# Altium project Hospital_Ward_Management_System_Project_V1I1.PrjPcb (part 3 of 3)
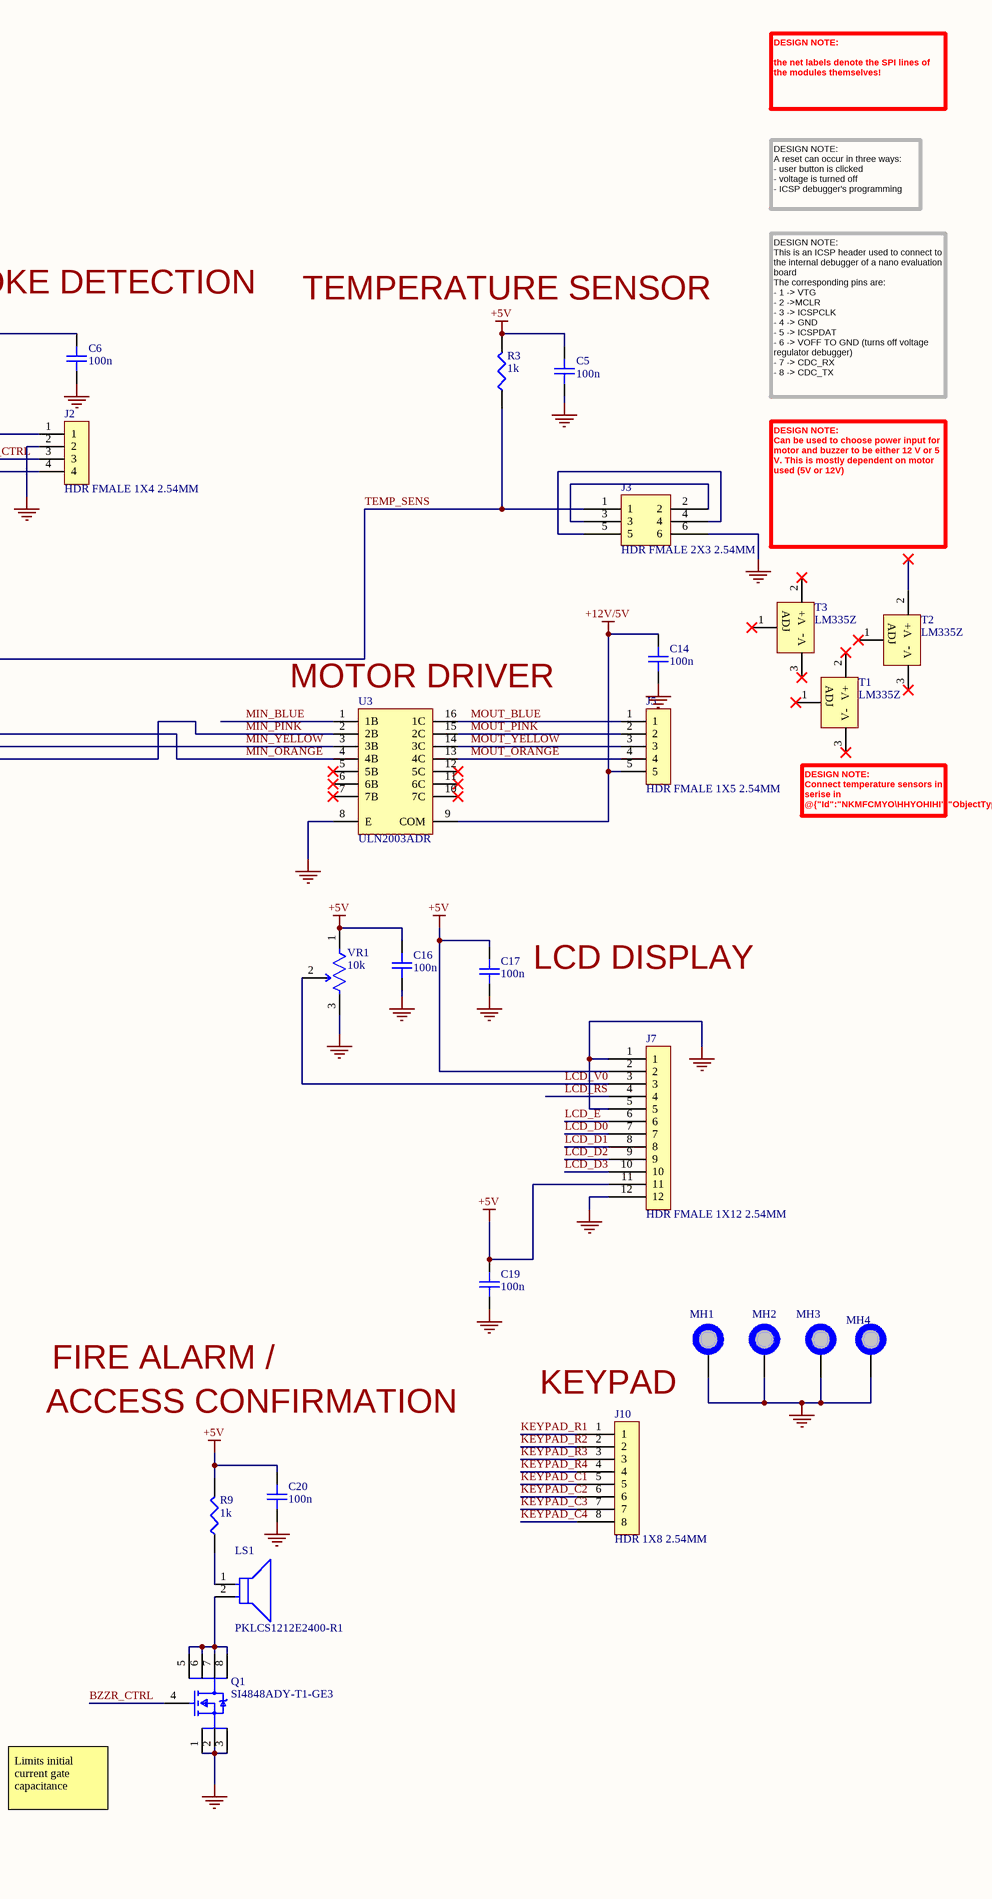
[diagram p7: [3] - PIC18F SUBSYSTEM SCHEMATIC.SchDoc, right]

## Sheet [3] - PIC18F SUBSYSTEM SCHEMATIC.SchDoc (continued)

### Library data of the parts (continued)
S1 = D6RLRDF1LFS: SPST, THT, 1.30N; Manufacturer: ITT C&K; Supplier: Mouser; Supplier Part Number: 611-D6RLRDF1LFS; Manufacturer Part Number: D6RLRDF1LFS; RoHS: No; Category: Pushbutton Switches; Stock: 1608; Pricing: 1=1.69, 10=1.28, 50=1.28, 100=1.19, 1000=1.08, 10000=1.08 (USD); ComponentLink1URL: http://datasheet.octopart.com/D6RLRDF1LFS-C%26K-Components-datasheet-156156663.pdf?src-supplier=Digikey; ComponentLink1Description: http://datasheet.octopart.com/D6RLRDF1LFS-C%26K-Components-datasheet-156156663.pdf?src-supplier=Digikey; ComponentLink2URL: http://datasheet.octopart.com/D6RLRDF1LFS-C%26K-Components-datasheet-156156663.pdf?src-supplier=Mouser; ComponentLink2Description: http://datasheet.octopart.com/D6RLRDF1LFS-C%26K-Components-datasheet-156156663.pdf?src-supplier=Mouser; ComponentLink3URL: http://datasheet.octopart.com/D6RLRDF1LFS-C%26K-Components-datasheet-156156663.pdf?src-supplier=Newark; ComponentLink3Description: http://datasheet.octopart.com/D6RLRDF1LFS-C%26K-Components-datasheet-156156663.pdf?src-supplier=Newark; ComponentLink4URL: http://datasheet.octopart.com/D6RLRDF1LFS-C%26K-Components-datasheet-156156663.pdf?src-supplier=Avnet; ComponentLink4Description: http://datasheet.octopart.com/D6RLRDF1LFS-C%26K-Components-datasheet-156156663.pdf?src-supplier=Avnet; ComponentLink5URL: http://datasheet.octopart.com/D6RLRDF1LFS-C%26K-Components-datasheet-156156663.pdf?src-supplier=Rs; ComponentLink5Description: http://datasheet.octopart.com/D6RLRDF1LFS-C%26K-Components-datasheet-156156663.pdf?src-supplier=Rs; ComponentLink6URL: http://datasheet.octopart.com/D6RLRDF1LFS-C%26K-Components-datasheet-156156663.pdf?src-supplier=Allied+Electronics; ComponentLink6Description: http://datasheet.octopart.com/D6RLRDF1LFS-C%26K-Components-datasheet-156156663.pdf?src-supplier=Allied+Electronics; ComponentLink7URL: http://datasheet.octopart.com/D6RLRDF1LFS-C%26K-Components-datasheet-156156663.pdf?src-supplier=Onlinecomponents.com; ComponentLink7Description: http://datasheet.octopart.com/D6RLRDF1LFS-C%26K-Components-datasheet-156156663.pdf?src-supplier=Onlinecomponents.com; ComponentLink8URL: http://datasheet.octopart.com/D6RLRDF1LFS-C%26K-Components-datasheet-156156663.pdf?src-supplier=TME; ComponentLink8Description: http://datasheet.octopart.com/D6RLRDF1LFS-C%26K-Components-datasheet-156156663.pdf?src-supplier=TME; ComponentLink9URL: http://datasheet.octopart.com/D6RLRDF1LFS-C%26K-Components-datasheet-156156663.pdf?src-supplier=Electro+Sonic; ComponentLink9Description: http://datasheet.octopart.com/D6RLRDF1LFS-C%26K-Components-datasheet-156156663.pdf?src-supplier=Electro+Sonic; ComponentLink10URL: http://datasheet.octopart.com/D6RLRDF1LFS-C%26K-Components-datasheet-156156663.pdf?src-supplier=LCSC; ComponentLink10Description: http://datasheet.octopart.com/D6RLRDF1LFS-C%26K-Components-datasheet-156156663.pdf?src-supplier=LCSC; ComponentLink11URL: http://datasheet.octopart.com/D6RLRDF1LFS-C%26K-Components-datasheet-156156663.pdf?src-supplier=Sager+Electronics; ComponentLink11Description: http://datasheet.octopart.com/D6RLRDF1LFS-C%26K-Components-datasheet-156156663.pdf?src-supplier=Sager+Electronics; Supplier 1: Mouser; Supplier Part Number 1: 611-D6RLRDF1LFS
SW2 = 1825910-6: Keypad Switch, 1 Switches, SPST, Momentary-tactile, 0.05A, 24VDC, 2.06N, 4 PCB Hole Cnt, Solder Terminal, Through Hole-straight; Manufacturer: TE Connectivity Alcoswitch; Circuit Configuration: 1X1; Contact Current(DC)-Max: 50mA; Number of Switches: 1; Contact DC Max Rating R Load: .05A@24VDC; Contact Voltage(DC)-Max: 24V; Body Breadth: 5.99mm; Body Height: 3.61mm; Supplier: Digikey; Supplier Part Number: 450-1650-ND; Manufacturer Part Number: 1825910-6; RoHS: Yes; Category: Pushbutton Switches; Stock: 75583; Pricing: 1=0.16, 10=0.132, 25=0.1216, 100=0.1072, 250=0.09864, 750=0.08917, 1500=0.08362, 3000=0.07836, 5250=0.07432 (USD); Mounting Technology: Through Hole; Min Operating Temperature: -35°C; Max Operating Temperature: 85°C; Operating Force-Max: 2.06N; Switch Action: MOMENTARY; Switch Type: Keypad; Termination: Solder; Switch Function: SPST; Body Length or Diameter: 5.99mm; Reach SVHC Compliant: Yes; RoHS Compliant: Yes; ComponentLink1URL: https://datasheet.ciiva.com:443/pdfs/VipMasterIC/IC/TYEL/TYEL-S-A0008869674/TYEL-S-A0008850909-1.pdf?src-supplier=IHS+Markit; ComponentLink1Description: https://datasheet.ciiva.com:443/pdfs/VipMasterIC/IC/TYEL/TYEL-S-A0008869674/TYEL-S-A0008850909-1.pdf?src-supplier=IHS+Markit; ComponentLink2URL: https://datasheet.ciiva.com/15184/getdatasheetpartid-395915-15184509.pdf?src-supplier=Verical; ComponentLink2Description: https://datasheet.ciiva.com/15184/getdatasheetpartid-395915-15184509.pdf?src-supplier=Verical; Supplier 1: Digikey; Supplier Part Number 1: 450-1650-ND
T1-T3 = LM335Z: Analog Voltage Output Sensor, 2.95V Min, 3.01V Max, 1Cel, Bipolar, Round, 3 Pin, Through Hole Mount; Manufacturer: STMicroelectronics; Package Body Material: Plastic; Accuracy-Max (Cel): 1°C; Operating Current-Max: 5mA; Package Equivalence Code: SIP3,.1,50; Sensor Type: TEMPERATURE SENSOR,ANALOG,VOLTAGE OUTPUT; Body Height: 5mm; Body Breadth: 4mm; Supplier: Mouser; Supplier Part Number: 511-LM335Z; Manufacturer Part Number: LM335Z; RoHS: Yes; Category: Temperature and Humidity Sensors; Stock: 14891; Pricing: 1=0.49, 10=0.368, 50=0.368, 100=0.334, 1000=0.265, 10000=0.209 (USD); Mounting Technology: Through Hole; Pins: 3; Housing Material: Plastic; Package Shape/Style: Round; Terminal Finish: Tin; Min Operating Temperature: -40°C; Max Operating Temperature: 100°C; JESD-609 Code: e3; Technology: BIPOLAR; Termination: Solder; Max Output Voltage: 3.01V; Min Output Voltage: 2.95V; Linearity (Cel): 1°C; Body Length or Diameter: 5mm; Reach SVHC Compliant: Yes; RoHS Compliant: Yes; ComponentLink1URL: https://datasheet.ciiva.com:443/pdfs/VipMasterIC/IC/SGST/SGSTS29694/SGSTS29694-1.pdf?src-supplier=IHS+Markit; ComponentLink1Description: https://datasheet.ciiva.com:443/pdfs/VipMasterIC/IC/SGST/SGSTS29694/SGSTS29694-1.pdf?src-supplier=IHS+Markit; ComponentLink2URL: https://datasheet.ciiva.com/15098/getdatasheetpartid-116959-15098226.pdf?src-supplier=Verical; ComponentLink2Description: https://datasheet.ciiva.com/15098/getdatasheetpartid-116959-15098226.pdf?src-supplier=Verical; ComponentLink3URL: https://datasheet.ciiva.com/1166/1837109-1166271.pdf?src-supplier=Element14; ComponentLink3Description: https://datasheet.ciiva.com/1166/1837109-1166271.pdf?src-supplier=Element14; ComponentLink4URL: https://datasheet.ciiva.com/16456/cd00000459-16456813.pdf?src-supplier=Future+Electronics; ComponentLink4Description: https://datasheet.ciiva.com/16456/cd00000459-16456813.pdf?src-supplier=Future+Electronics; ComponentLink5URL: https://datasheet.ciiva.com/2847/cd00000459-2847763.pdf?src-supplier=Digikey; ComponentLink5Description: https://datasheet.ciiva.com/2847/cd00000459-2847763.pdf?src-supplier=Digikey; Supplier 1: Mouser; Supplier Part Number 1: 511-LM335Z
U1 = TL1963A-33DCQR: LDO Regulator Pos 3.3V 1.5A 6-Pin(5+Tab) SOT-223 T/R; Manufacturer: Texas Instruments; Dropout Voltage: 340mV; Number of Outputs: 1; Max Supply Voltage: 20V; Min Input Voltage: 2.1V; Min Current Limit: 1.6A; Input Bias Current: 1mA; Polarity: Positive; Accuracy: 3%; Output Type: Fixed; Supplier: Digikey; Supplier Part Number: 296-24534-1-ND; Manufacturer Part Number: TL1963A-33DCQR; RoHS: Yes; Category: Voltage Regulators - Linear; Stock: 8694; Pricing: 1=3.3, 10=2.479, 25=2.2736, 100=2.0475, 250=1.93968, 500=1.87468, 1000=1.82118 (USD); Case/Package: SOT-223-6; Pins: 6; Min Operating Temperature: -40°C; Max Operating Temperature: 125°C; Package Quantity: 1; Packaging: Tape and Reel; Output Voltage: 3.3V; Output Current: 1.5A; Max Output current: 1.5A; Number of Regulators: 1; Quiescent Current: 1mA; Max Output Voltage: 3.3V; Min Output Voltage: 3.3V; Series: -; Radiation Hardening: No; Lead Free: Lead Free; RoHS Compliant: Yes; ComponentLink1URL: https://datasheet.ciiva.com/2046/tl1963a-2046162.pdf?src-supplier=Digikey; ComponentLink1Description: https://datasheet.ciiva.com/2046/tl1963a-2046162.pdf?src-supplier=Digikey; ComponentLink2URL: https://datasheet.ciiva.com/2046/tl1963a-2046161.pdf?src-supplier=Digikey; ComponentLink2Description: https://datasheet.ciiva.com/2046/tl1963a-2046161.pdf?src-supplier=Digikey; ComponentLink3URL: https://datasheet.ciiva.com/2046/tl1963a-2046163.pdf?src-supplier=Digikey; ComponentLink3Description: https://datasheet.ciiva.com/2046/tl1963a-2046163.pdf?src-supplier=Digikey; Supplier 1: Digikey; Supplier Part Number 1: 296-24534-1-ND
U2 = PIC18F57Q43-I/PT: RISC Microcontroller, 8-Bit, FLASH, PIC18 CPU, 64MHz, CMOS, PQFP48; Manufacturer: Microchip; Supplier: Farnell; Supplier Part Number: 3052757; Manufacturer Part Number: PIC18F57Q43-I/PT; RoHS: No; Category: Microcontrollers; Stock: 226; Pricing: 1=2.12, 25=1.94, 100=1.86, 250=1.78 (EUR); RoHS Compliant: Yes; ComponentLink1URL: https://datasheet.ciiva.com:443/pdfs/VipMasterIC/IC/MCHP/MCHP-S-A0009762681/MCHP-S-A0009762681-1.pdf?src-supplier=IHS+Markit; ComponentLink1Description: https://datasheet.ciiva.com:443/pdfs/VipMasterIC/IC/MCHP/MCHP-S-A0009762681/MCHP-S-A0009762681-1.pdf?src-supplier=IHS+Markit; Supplier 1: Farnell; Supplier Part Number 1: 3052757
U3 = ULN2003ADR: 50-V, 7-ch darlington transistor array, -20C to 70C 16-SOIC -40 to 70; Manufacturer: Texas Instruments; Number of Elements: 7; Polarity: NPN; Collector Emitter Voltage (VCEO): 50V; Max Collector Current: 500mA; Collector Emitter Saturation Voltage: 1.1V; Collector-emitter Voltage-Max: 1.6V; Supplier: Mouser; Supplier Part Number: 595-ULN2003ADR; Manufacturer Part Number: ULN2003ADR; RoHS: Yes; Category: Integrated Circuits (ICs); Stock: 207108; Pricing: 1=0.45, 10=0.3, 50=0.3, 100=0.159, 1000=0.144, 10000=0.095 (USD); Mounting Technology: Surface Mount; Case/Package: SOIC; Pins: 16; Weight: 0.004998oz; Min Operating Temperature: -20°C; Max Operating Temperature: 70°C; Package Quantity: 2500; Packaging: Tape and Reel; Collector Emitter Breakdown Voltage: 50V; Series: Automotive, AEC-Q100; Number of Drivers: 7; Max Breakdown Voltage: 50V; Voltage Rating (DC): 50V; Current Rating: 500mA; Length: 9.9mm; Width: 3.91mm; Height: 1.58mm; Radiation Hardening: No; Lead Free: Lead Free; RoHS Compliant: Yes; Reach SVHC Compliant: No; ComponentLink1URL: https://datasheet.ciiva.com/27049/700605-27049624.pdf?src-supplier=Jameco; ComponentLink1Description: https://datasheet.ciiva.com/27049/700605-27049624.pdf?src-supplier=Jameco; ComponentLink2URL: https://datasheet.ciiva.com/1193/1851982-1193407.pdf?src-supplier=Element14; ComponentLink2Description: https://datasheet.ciiva.com/1193/1851982-1193407.pdf?src-supplier=Element14; ComponentLink3URL: https://datasheet.ciiva.com/46423/1831474-46423371.pdf?src-supplier=Element14; ComponentLink3Description: https://datasheet.ciiva.com/46423/1831474-46423371.pdf?src-supplier=Element14; ComponentLink4URL: https://datasheet.ciiva.com/1700/uln2003a-1700767.pdf?src-supplier=Digikey; ComponentLink4Description: https://datasheet.ciiva.com/1700/uln2003a-1700767.pdf?src-supplier=Digikey; ComponentLink5URL: https://datasheet.ciiva.com/1700/uln2003a-1700766.pdf?src-supplier=Digikey; ComponentLink5Description: https://datasheet.ciiva.com/1700/uln2003a-1700766.pdf?src-supplier=Digikey; ComponentLink6URL: https://datasheet.ciiva.com/1700/uln2003a-1700768.pdf?src-supplier=Digikey; ComponentLink6Description: https://datasheet.ciiva.com/1700/uln2003a-1700768.pdf?src-supplier=Digikey; Supplier 1: Mouser; Supplier Part Number 1: 595-ULN2003ADR
U4 U5 = SN74AHC1G09DBVR: AND Gate, AHC/VHC/H/U/V Series, 1-Func, 2-Input, CMOS, PDSO5; Manufacturer: Texas Instruments; Package Body Material: Plastic; Load Capacitance (CL): 50pF; Max I(ol): 8mA; Channels: 1; Number of Inputs: 2; Output Characteristics: OPEN-DRAIN; Package Equivalence Code: TSOP5/6,.11,37; Power Supplies: 2/5.5V; Prop. Delay@Nom-Sup: 8.5ns; Propagation Delay (tpd): 12.5ns; Schmitt Trigger: No; Max Supply Voltage: 5.5V; Min Supply Voltage: 2V; Nominal Supply Voltage: 3.3V; Qualification Status: Not Qualified; Supplier: Digikey; Supplier Part Number: 296-29202-1-ND; Manufacturer Part Number: SN74AHC1G09DBVR; RoHS: Yes; Category: Logic Gates; Stock: 15774; Pricing: 1=0.12, 10=0.08, 25=0.0704, 100=0.0594, 250=0.05408, 500=0.05088, 1000=0.04826 (USD); Case/Package: LSSOP; Pins: 5; Package Shape: Rectangular; Terminal Finish: Nickel; Min Operating Temperature: -55°C; Max Operating Temperature: 125°C; JESD-609 Code: e4; JESD-30 Code: R-PDSO-G5; Logic Type: AND GATE; Moisture Sensitivity Level: 1; Package Style: SMALL OUTLINE, LOW PROFILE, SHRINK PITCHMeter; Packaging: Tape and Reel; Peak Reflow Temperature (Cel): 260°C; Surface Mount: Yes; Technology: CMOS; Terminal Form: Gull Wing; Terminal Position: DUAL; Length: 2.9mm; Width: 1.6mm; Height - Seated (Max): 1.45mm; Terminal Pitch: 0.95mm; Temperature Grade: MILITARY; Reach SVHC Compliant: Yes; RoHS Compliant: Yes; ComponentLink1URL: https://www.ti.com:443/lit/ds/symlink/sn74ahc1g09.pdf?src-supplier=IHS+Markit; ComponentLink1Description: https://www.ti.com:443/lit/ds/symlink/sn74ahc1g09.pdf?src-supplier=IHS+Markit; ComponentLink2URL: https://datasheet.ciiva.com/1864/sn74ahc1g09-1864411.pdf?src-supplier=Digikey; ComponentLink2Description: https://datasheet.ciiva.com/1864/sn74ahc1g09-1864411.pdf?src-supplier=Digikey; ComponentLink3URL: https://datasheet.ciiva.com/1864/sn74ahc1g09-1864410.pdf?src-supplier=Digikey; ComponentLink3Description: https://datasheet.ciiva.com/1864/sn74ahc1g09-1864410.pdf?src-supplier=Digikey; ComponentLink4URL: https://datasheet.ciiva.com/1864/sn74ahc1g09-1864412.pdf?src-supplier=Digikey; ComponentLink4Description: https://datasheet.ciiva.com/1864/sn74ahc1g09-1864412.pdf?src-supplier=Digikey; Supplier 1: Digikey; Supplier Part Number 1: 296-29202-1-ND
VR1 = 3361P-1-103GLF: Trimmer, Cermet, 0.5W, 10000ohm, 10% +/-Tol, 1 Turn(s); Manufacturer: Bourns; Manufacturer Series: 3361; Actuator Orientation: Vertical; Actuator Type: SCREW; Number of Turns: 1; Power: 500mW; Rated Temperature: 70°C; Value: 10kR; Resistance Law: Linear; Supplier: Mouser; Supplier Part Number: 652-3361P-1-103GLF; Manufacturer Part Number: 3361P-1-103GLF; RoHS: Yes; Category: Variable Resistors and Potentiometers; Stock: 17617; Pricing: 1=1.24, 10=0.944, 50=0.944, 100=0.808, 1000=0.602, 10000=0.567 (USD); Mounting Technology: Surface Mount; Pins: 3; Package Shape: Rectangular; Terminal Finish: Tin; Min Operating Temperature: -55°C; Max Operating Temperature: 125°C; Tolerance: 10%; JESD-609 Code: e3; Resistor Type: TRIMMER; Packaging: Tape and Reel; Technology: CERMET; Termination: Flat; Reach SVHC Compliant: Yes; RoHS Compliant: Yes; ComponentLink1URL: https://datasheet.ciiva.com:443/pdfs/VipMasterIC/IC/BOUR/BOUR-S-A0008933114/BOUR-S-A0008933114-1.pdf?src-supplier=IHS+Markit; ComponentLink1Description: https://datasheet.ciiva.com:443/pdfs/VipMasterIC/IC/BOUR/BOUR-S-A0008933114/BOUR-S-A0008933114-1.pdf?src-supplier=IHS+Markit; ComponentLink2URL: https://datasheet.ciiva.com/27747/2033640-27747919.pdf?src-supplier=Jameco; ComponentLink2Description: https://datasheet.ciiva.com/27747/2033640-27747919.pdf?src-supplier=Jameco; ComponentLink3URL: https://datasheet.ciiva.com/11833/0900766b80fe1d0c-11833213.pdf?src-supplier=Rs; ComponentLink3Description: https://datasheet.ciiva.com/11833/0900766b80fe1d0c-11833213.pdf?src-supplier=Rs; ComponentLink4URL: https://datasheet.ciiva.com/1477/1846252-1477716.pdf?src-supplier=Element14; ComponentLink4Description: https://datasheet.ciiva.com/1477/1846252-1477716.pdf?src-supplier=Element14; ComponentLink5URL: https://datasheet.ciiva.com/1477/1846252-1477717.pdf?src-supplier=Element14; ComponentLink5Description: https://datasheet.ciiva.com/1477/1846252-1477717.pdf?src-supplier=Element14; ComponentLink6URL: https://datasheet.ciiva.com/3266/3361-3266293.pdf?src-supplier=Avnet; ComponentLink6Description: https://datasheet.ciiva.com/3266/3361-3266293.pdf?src-supplier=Avnet; ComponentLink7URL: https://datasheet.ciiva.com/2156/3361-2156171.pdf?src-supplier=Digikey; ComponentLink7Description: https://datasheet.ciiva.com/2156/3361-2156171.pdf?src-supplier=Digikey; ComponentLink8URL: https://datasheet.ciiva.com/2156/3361-2156172.pdf?src-supplier=Digikey; ComponentLink8Description: https://datasheet.ciiva.com/2156/3361-2156172.pdf?src-supplier=Digikey; ComponentLink9URL: https://datasheet.ciiva.com/2156/3361-2156170.pdf?src-supplier=Digikey; ComponentLink9Description: https://datasheet.ciiva.com/2156/3361-2156170.pdf?src-supplier=Digikey; ComponentLink10URL: https://datasheet.ciiva.com/30200/3361-30200607.pdf?src-supplier=Onlinecomponents.com; ComponentLink10Description: https://datasheet.ciiva.com/30200/3361-30200607.pdf?src-supplier=Onlinecomponents.com; Supplier 1: Mouser; Supplier Part Number 1: 652-3361P-1-103GLF

## Sheet [4] - ESP32 SUBSYSTEM SCHEMATIC.SchDoc
size A2; DocumentNumber: 4; SheetNumber: 4; SheetTotal: 6

### Parts
(Parts that share a designator on the sheet are numbered #1, #2 ... from top to bottom, then left to right.)
?#2  (no value)  (graphical)

### Notes on the sheet
- Title:
- Page Contents:
- Variant:
- Checked by
- Size:
- Date:
- DWG NO
- Designed by
- Sheet
- of
- Revision:

### Library data of the parts
?#2 = SDTitleBlock

## Sheet [5] - REVISION HISTORY.SchDoc
size A3; DocumentNumber: 5; SheetNumber: 5; SheetTotal: 6
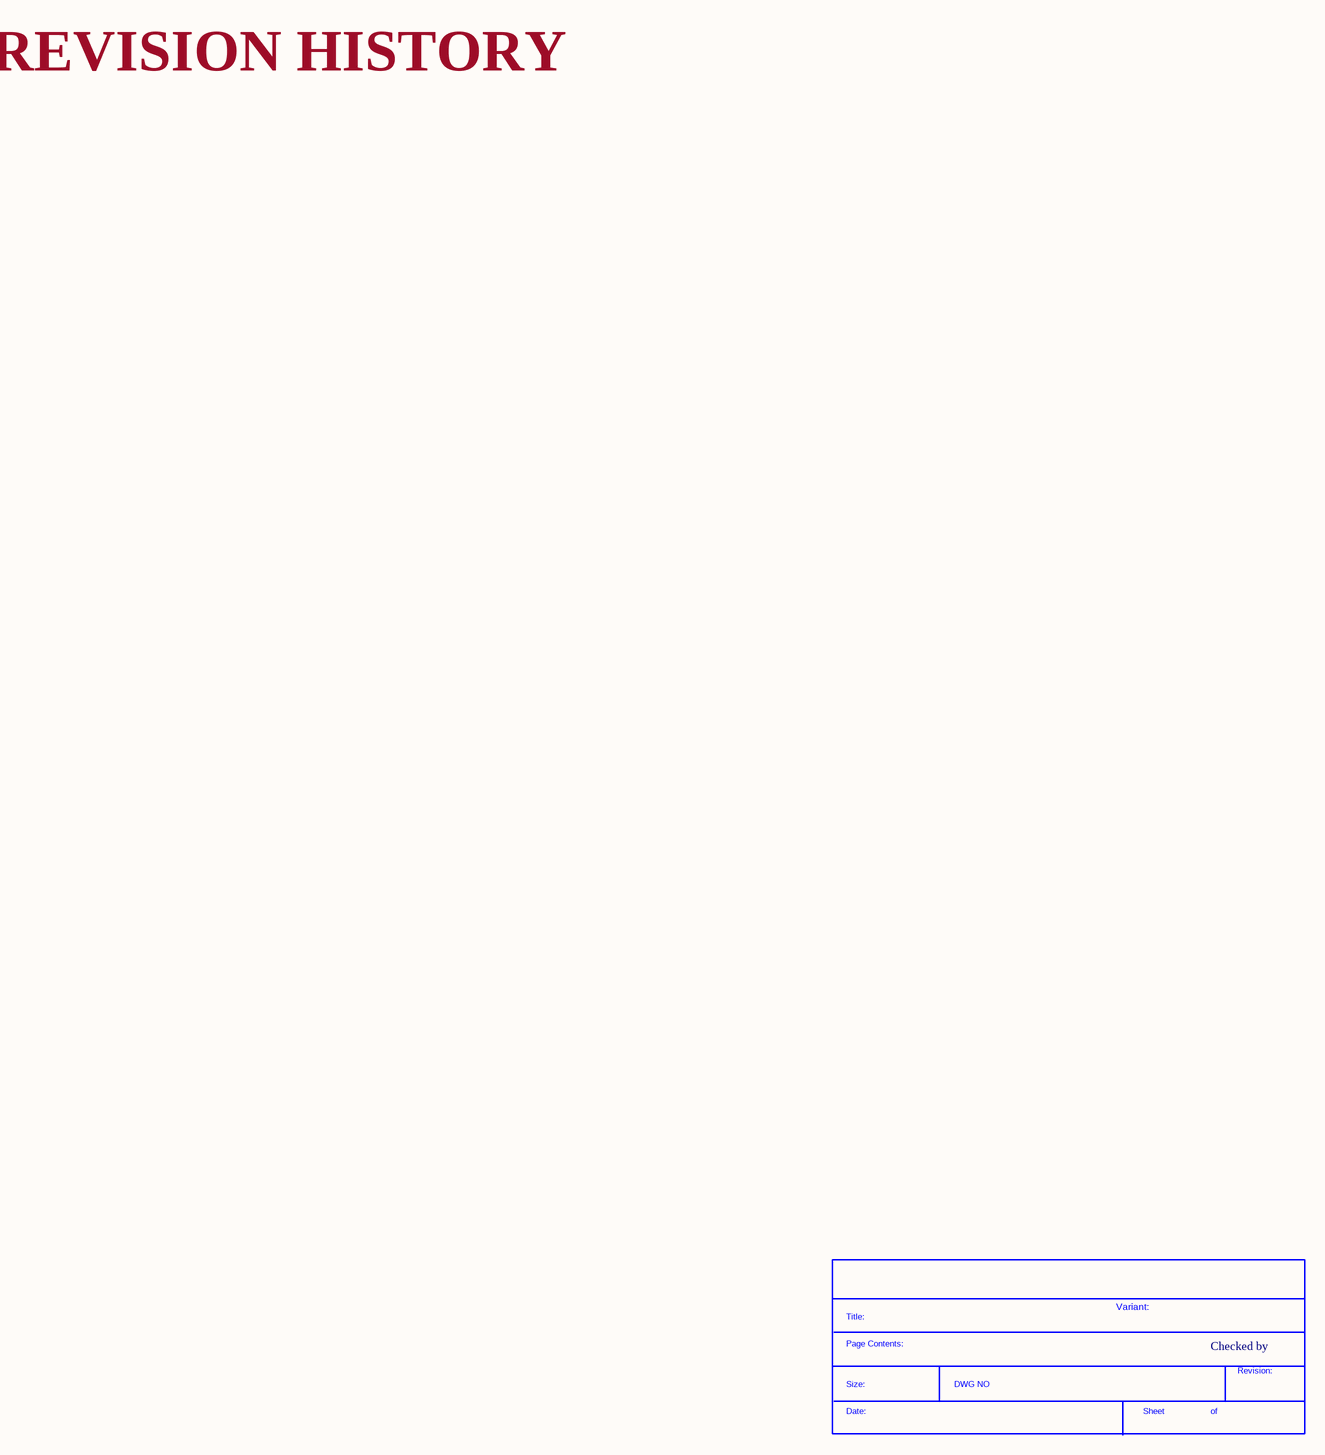
[diagram p5: [5] - REVISION HISTORY.SchDoc]

### Parts
(Parts that share a designator on the sheet are numbered #1, #2 ... from top to bottom, then left to right.)
*#4  SDTitleBlock  (value not drawn)  (graphical)

### Notes on the sheet
- REVISION HISTORY
- Variant:
- Checked by
- (in symbol SDTitleBlock) Title:; Page Contents:; Revision:; Size:; DWG NO; Date:; Sheet; of

## Assembly variants
Fixed 12V: not fitted JP1 LINK1 R2